# EAGLE design MonoPedal (EAGLE 9.6.2)

## Sheet 1 of 2: Audio & Power
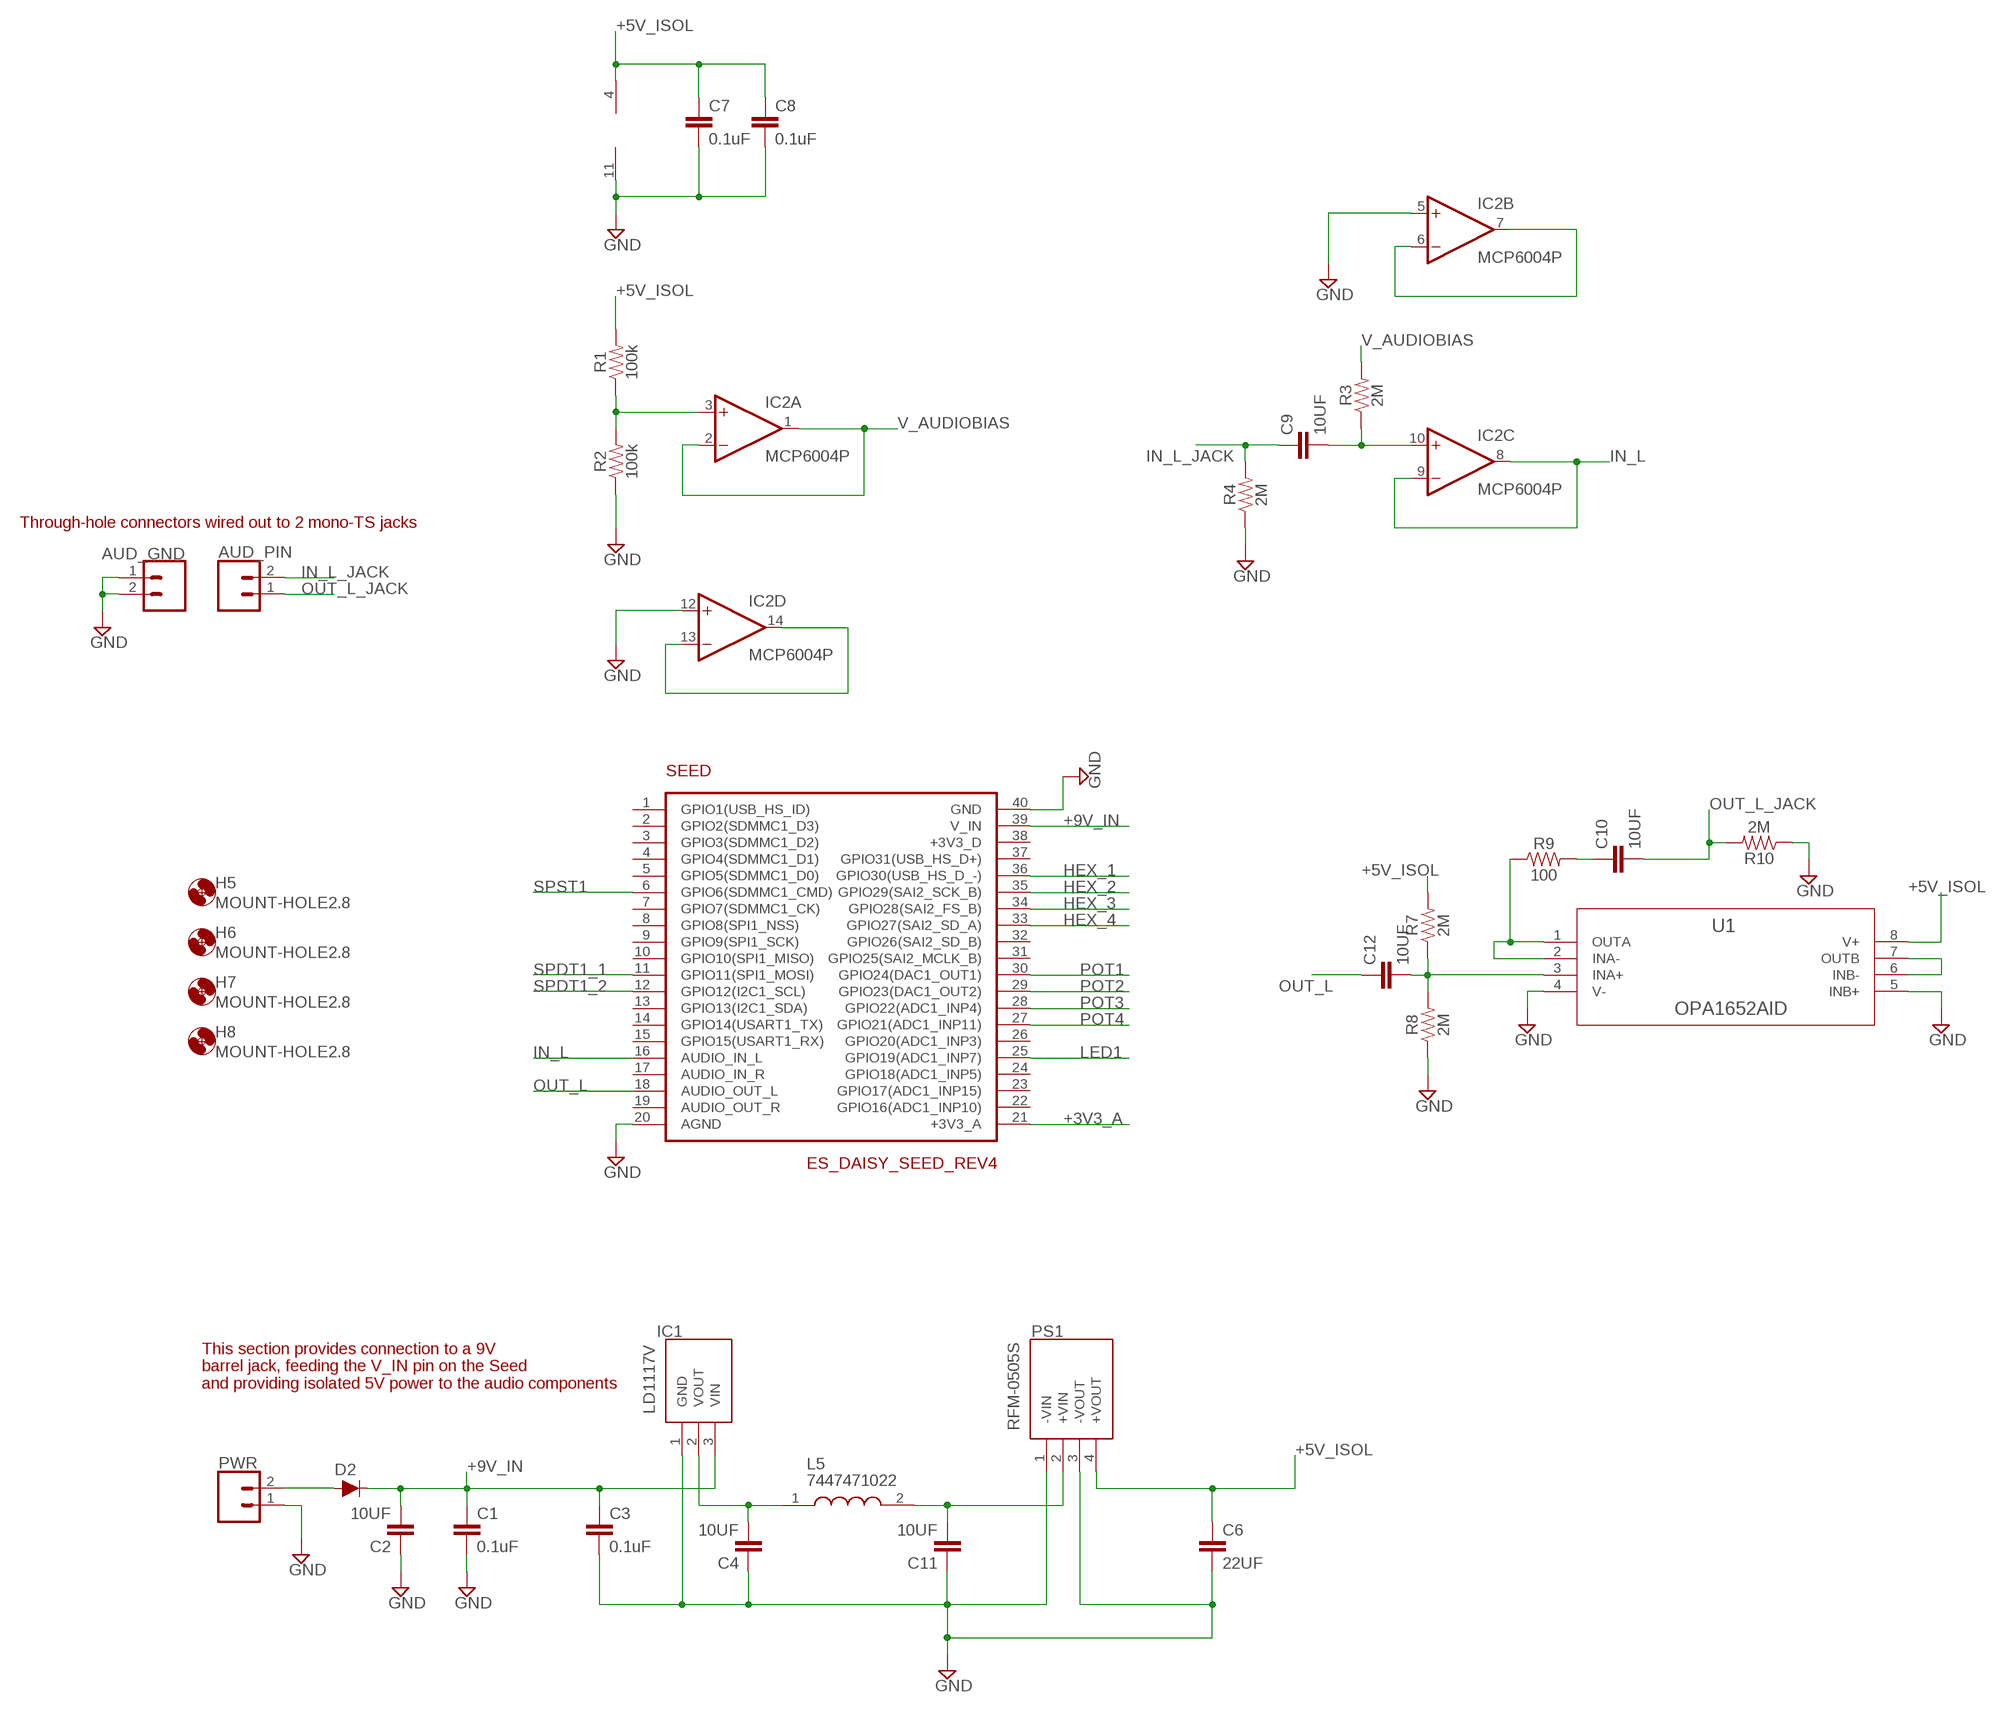
[diagram p0: schematic, sheet 1]

### Parts
AUD_GND  CONN_02  [1X02]
AUD_PIN  CONN_02  [1X02]
C1  0.1uF  0.1UF-KIT-EZ-50V-20%  [CAP-PTH-SMALL-KIT]
C2  10UF  [CAP-PTH-SMALL-KIT]
C3  0.1uF  0.1UF-KIT-EZ-50V-20%  [CAP-PTH-SMALL-KIT]
C4  10UF  [CAP-PTH-SMALL-KIT]
C6  22UF  [CAP-PTH-SMALL-KIT]
C7  0.1uF  0.1UF-KIT-EZ-50V-20%  [CAP-PTH-SMALL-KIT]
C8  0.1uF  0.1UF-KIT-EZ-50V-20%  [CAP-PTH-SMALL-KIT]
C9  10UF  [CAP-PTH-SMALL-KIT]
C10  10UF  [CAP-PTH-SMALL-KIT]
C11  10UF  [CAP-PTH-SMALL-KIT]
C12  10UF  [CAP-PTH-SMALL-KIT]
D2  200mA/100V/1V  DIODE-1N4148  [DIODE-1N4148]
H5  MOUNT-HOLE2.8  [2,8]
H6  MOUNT-HOLE2.8  [2,8]
H7  MOUNT-HOLE2.8  [2,8]
H8  MOUNT-HOLE2.8  [2,8]
IC1  LD1117V  [TO255P460X1020X2008-3P]
IC2  MCP6004P  [DIL14]
L5  7447471022  [WE-TIS_111190]
PS1  RFM-0505S  [RFM0505S]
PWR  CONN_02  [1X02]
R1  100k  100KOHM-HORIZ-1/4W-5%  [AXIAL-0.3]
R2  100k  100KOHM-HORIZ-1/4W-5%  [AXIAL-0.3]
R3  2M  2MOHM-HORIZ-1/4W-5%  [AXIAL-0.3]
R4  2M  2MOHM-HORIZ-1/4W-5%  [AXIAL-0.3]
R7  2M  2MOHM-HORIZ-1/4W-5%  [AXIAL-0.3]
R8  2M  2MOHM-HORIZ-1/4W-5%  [AXIAL-0.3]
R9  100  100OHM-HORIZ-1/4W-1%  [AXIAL-0.3]
R10  2M  2MOHM-HORIZ-1/4W-5%  [AXIAL-0.3]
SEED  ES_DAISY_SEED_REV4  [ES_DAISY_SEED]
U1  OPA1652AID  [D8]

### Nets
+3V3_A: SEED.21(+3V3_A) ; also sheet 2
+5V_ISOL: C6.1 C7.1 C8.1 IC2.4(P:V+) PS1.4(+VOUT) R1.P$2 R7.P$2 U1.8(V+)
+9V_IN: C1.1 C2.2 C3.1 D2.C IC1.3(VIN) SEED.39(V_IN)
GND: AUD_GND.1 AUD_GND.2 C1.2 C2.1 C3.2 C4.1 C6.2 C7.2 C8.2 C11.1 IC1.1(GND) IC2.5(B:+IN) IC2.11(P:V-) IC2.12(D:+IN) PS1.1(-VIN) PS1.3(-VOUT) PWR.1 R2.P$1 R4.P$1 R8.P$1 R10.P$1 SEED.20(AGND) SEED.40(GND) U1.4(V-) U1.5(INB+) ; also sheet 2
HEX_1: SEED.36(GPIO30(USB_HS_D_-)) ; also sheet 2
HEX_2: SEED.35(GPIO29(SAI2_SCK_B)) ; also sheet 2
HEX_3: SEED.34(GPIO28(SAI2_FS_B)) ; also sheet 2
HEX_4: SEED.33(GPIO27(SAI2_SD_A)) ; also sheet 2
IN_L: IC2.8(C:OUT) IC2.9(C:-IN) SEED.16(AUDIO_IN_L)
IN_L_JACK: AUD_PIN.2 C9.1 R4.P$2
LED1: SEED.25(GPIO19(ADC1_INP7)) ; also sheet 2
N$2: D2.A PWR.2
N$6: IC2.3(A:+IN) R1.P$1 R2.P$2
N$7: C11.2 L5.2 PS1.2(+VIN)
N$8: C4.2 IC1.2(VOUT) L5.1
N$9: C9.2 IC2.10(C:+IN) R3.P$1
N$10: IC2.13(D:-IN) IC2.14(D:OUT)
N$12: C12.2 R7.P$1 R8.P$2 U1.3(INA+)
N$13: R9.P$1 U1.1(OUTA) U1.2(INA-)
N$14: C10.1 R9.P$2
N$15: U1.6(INB-) U1.7(OUTB)
N$18: IC2.6(B:-IN) IC2.7(B:OUT)
OUT_L: C12.1 SEED.18(AUDIO_OUT_L)
OUT_L_JACK: AUD_PIN.1 C10.2 R10.P$2
POT1: SEED.30(GPIO24(DAC1_OUT1)) ; also sheet 2
POT2: SEED.29(GPIO23(DAC1_OUT2)) ; also sheet 2
POT3: SEED.28(GPIO22(ADC1_INP4)) ; also sheet 2
POT4: SEED.27(GPIO21(ADC1_INP11)) ; also sheet 2
SPDT1_1: SEED.11(GPIO11(SPI1_MOSI)) ; also sheet 2
SPDT1_2: SEED.12(GPIO12(I2C1_SCL)) ; also sheet 2
SPST1: SEED.6(GPIO6(SDMMC1_CMD)) ; also sheet 2
V_AUDIOBIAS: IC2.1(A:OUT) IC2.2(A:-IN) R3.P$2
Unconnected: SEED.1(GPIO1(USB_HS_ID)) SEED.2(GPIO2(SDMMC1_D3)) SEED.3(GPIO3(SDMMC1_D2)) SEED.4(GPIO4(SDMMC1_D1)) SEED.5(GPIO5(SDMMC1_D0)) SEED.7(GPIO7(SDMMC1_CK)) SEED.8(GPIO8(SPI1_NSS)) SEED.9(GPIO9(SPI1_SCK)) SEED.10(GPIO10(SPI1_MISO)) SEED.13(GPIO13(I2C1_SDA)) SEED.14(GPIO14(USART1_TX)) SEED.15(GPIO15(USART1_RX)) SEED.17(AUDIO_IN_R) SEED.19(AUDIO_OUT_R) SEED.22(GPIO16(ADC1_INP10)) SEED.23(GPIO17(ADC1_INP15)) SEED.24(GPIO18(ADC1_INP5)) SEED.26(GPIO20(ADC1_INP3)) SEED.31(GPIO25(SAI2_MCLK_B)) SEED.32(GPIO26(SAI2_SD_B)) SEED.37(GPIO31(USB_HS_D+)) SEED.38(+3V3_D)

### Notes on the sheet
- Through-hole connectors wired out to 2 mono-TS jacks
- This section provides connection to a 9V
  barrel jack, feeding the V_IN pin on the Seed 
  and providing isolated 5V power to the audio components

## Sheet 2 of 2: I/O
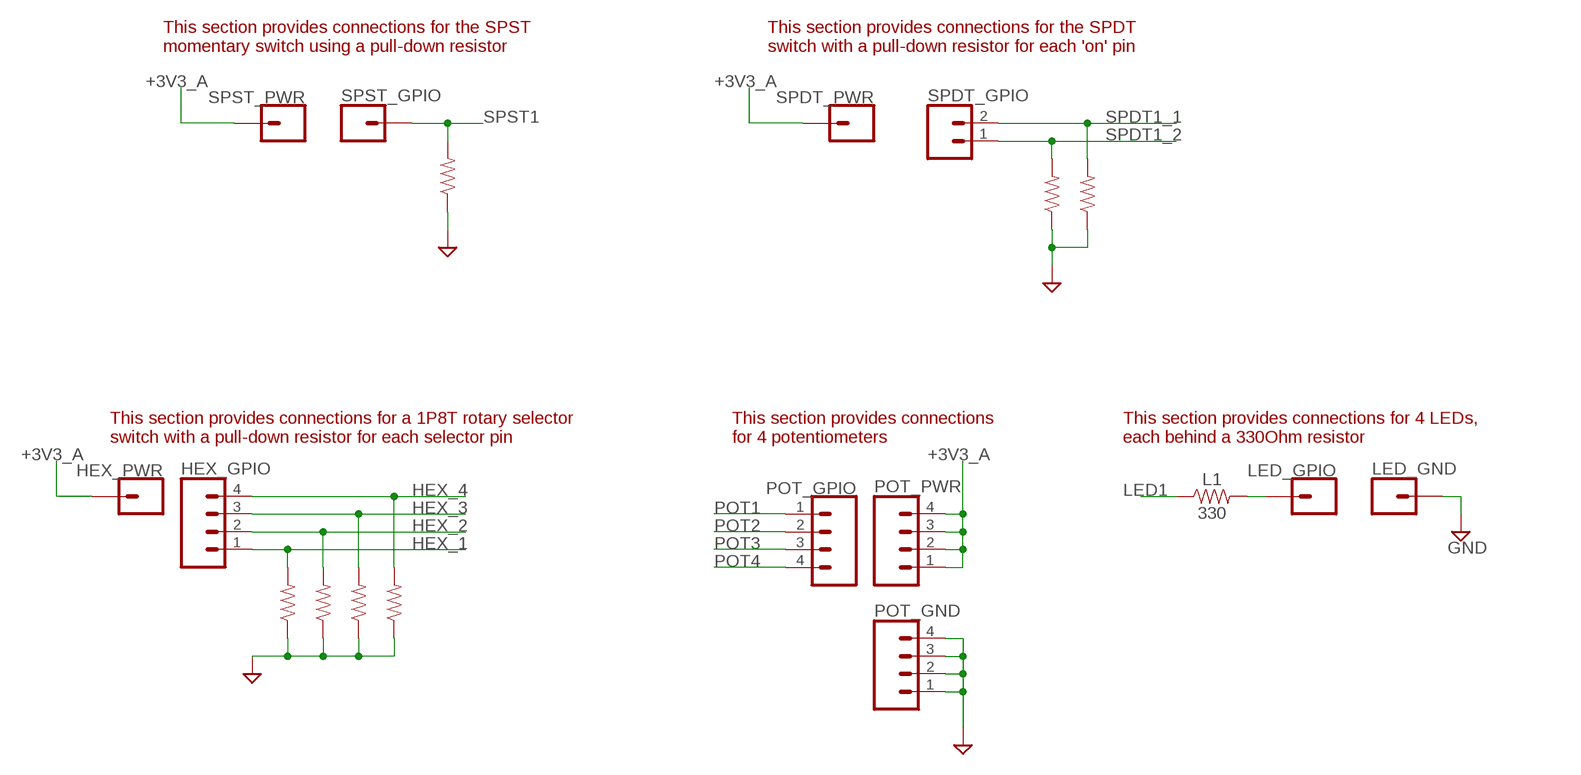
[diagram p1: schematic, sheet 2]

### Parts
D11  10k  10KOHM-HORIZ-1/4W-5%  [AXIAL-0.3]
D12  10k  10KOHM-HORIZ-1/4W-5%  [AXIAL-0.3]
H1  10k  10KOHM-HORIZ-1/4W-5%  [AXIAL-0.3]
H2  10k  10KOHM-HORIZ-1/4W-5%  [AXIAL-0.3]
H3  10k  10KOHM-HORIZ-1/4W-5%  [AXIAL-0.3]
H4  10k  10KOHM-HORIZ-1/4W-5%  [AXIAL-0.3]
HEX_GPIO  CONN_04  [1X04]
HEX_PWR  CONN_01  [1X01]
L1  330  330OHM-HORIZ-1/10W-5%  [AXIAL-0.3]
LED_GND  CONN_01  [1X01]
LED_GPIO  CONN_01  [1X01]
POT_GND  CONN_04  [1X04]
POT_GPIO  CONN_04  [1X04]
POT_PWR  CONN_04  [1X04]
S1  10k  10KOHM-HORIZ-1/4W-5%  [AXIAL-0.3]
SPDT_GPIO  CONN_02  [1X02]
SPDT_PWR  CONN_01  [1X01]
SPST_GPIO  CONN_01  [1X01]
SPST_PWR  CONN_01  [1X01]

### Nets
+3V3_A: HEX_PWR.1 POT_PWR.1 POT_PWR.2 POT_PWR.3 POT_PWR.4 SPDT_PWR.1 SPST_PWR.1 ; also sheet 1
GND: D11.P$1 D12.P$1 H1.P$1 H2.P$1 H3.P$1 H4.P$1 LED_GND.1 POT_GND.1 POT_GND.2 POT_GND.3 POT_GND.4 S1.P$1 ; also sheet 1
HEX_1: H1.P$2 HEX_GPIO.1 ; also sheet 1
HEX_2: H2.P$2 HEX_GPIO.2 ; also sheet 1
HEX_3: H3.P$2 HEX_GPIO.3 ; also sheet 1
HEX_4: H4.P$2 HEX_GPIO.4 ; also sheet 1
LED1: L1.P$1 ; also sheet 1
N$1: L1.P$2 LED_GPIO.1
POT1: POT_GPIO.1 ; also sheet 1
POT2: POT_GPIO.2 ; also sheet 1
POT3: POT_GPIO.3 ; also sheet 1
POT4: POT_GPIO.4 ; also sheet 1
SPDT1_1: D11.P$2 SPDT_GPIO.2 ; also sheet 1
SPDT1_2: D12.P$2 SPDT_GPIO.1 ; also sheet 1
SPST1: S1.P$2 SPST_GPIO.1 ; also sheet 1

### Notes on the sheet
- This section provides connections for the SPST 
  momentary switch using a pull-down resistor
- This section provides connections for the SPDT 
  switch with a pull-down resistor for each 'on' pin
- This section provides connections for a 1P8T rotary selector
  switch with a pull-down resistor for each selector pin
- This section provides connections
  for 4 potentiometers
- This section provides connections for 4 LEDs,
  each behind a 330Ohm resistor

## Library data of the parts
AUD_GND AUD_PIN PWR SPDT_GPIO = SparkFun-Connectors:CONN_02: Multi connection point. Often used as Generic Header-pin footprint for 0.1 inch spaced/style header connections On any of the 0.1 inch spaced packages, you can populate with these: Break Away Headers - Straight <https://www.sparkfun.com/products/116> (PRT-00116) Break Away Male Headers - Right Angle <https://www.sparkfun.com/products/553> (PRT-00553) Female Headers <https://www.sparkfun.com/products/115> (PRT-00115) Break Away Headers - Machine Pin <https://www.sparkfun.com/products/117> (PRT-00117) Break Away Female Headers - Swiss Machine Pin <https://www.sparkfun.com/products/743> (PRT-00743) For SCREWTERMINALS and SPRING TERMINALS visit here: Screw Terimnals on SparkFun.com <https://www.sparkfun.com/search/results?term=Screw+Terminals> (5mm/3.5mm/2.54mm spacing) This device is also useful as a general connection point to wire up your design to another part of your project. Our various solder wires solder well into these plated through hole pads. Hook-Up Wire - Assortment (Stranded, 22 AWG) <https://www.sparkfun.com/products/11375> (PRT-11375) Hook-Up Wire - Assortment (Solid Core, 22 AWG) <https://www.sparkfun.com/products/11367> (PRT-11367) View the entire wire category on our website here <https://www.sparkfun.com/categories/141> Special notes: Molex polarized connector foot print use with: PRT-08233 with associated crimp pins and housings. 2.54_SCREWTERM for use with PRT-10571. 3.5mm Screw Terminal footprints for PRT-08084 5mm Screw Terminal footprints for use with PRT-08432
C1 C3 C7 C8 = SparkFun-Capacitors:0.1UF: 0.1µF ceramic capacitors A capacitor is a passive two-terminal electrical component used to store electrical energy temporarily in an electric field.; PROD_ID: CAP-08370
C2 C4 C9-C12 = Custom-Parts:10UF
C6 = Custom-Parts:22UF
D2 = SparkFun-DiscreteSemi:DIODE: Diode These are standard reverse protection diodes and small signal diodes. SparkFun Products: SparkFun SparkPunk Sound Kit <https://www.sparkfun.com/products/11177> SparkFun ESP8266 Thing <https://www.sparkfun.com/products/13231>; PROD_ID: DIO-08378
D11 D12 H1-H4 S1 = SparkFun-Resistors:10KOHM: 10kΩ resistor A resistor is a passive two-terminal electrical component that implements electrical resistance as a circuit element. Resistors act to reduce current flow, and, at the same time, act to lower voltage levels within circuits. - Wikipedia; PROD_ID: RES-09435
H5-H8 = holes:MOUNT-HOLE: MOUNTING HOLE with drill center marker
HEX_GPIO POT_GND POT_GPIO POT_PWR = SparkFun-Connectors:CONN_04: Multi connection point. Often used as Generic Header-pin footprint for 0.1 inch spaced/style header connections On any of the 0.1 inch spaced packages, you can populate with these: Break Away Headers - Straight <https://www.sparkfun.com/products/116> (PRT-00116) Break Away Male Headers - Right Angle <https://www.sparkfun.com/products/553> (PRT-00553) Female Headers <https://www.sparkfun.com/products/115> (PRT-00115) Break Away Headers - Machine Pin <https://www.sparkfun.com/products/117> (PRT-00117) Break Away Female Headers - Swiss Machine Pin <https://www.sparkfun.com/products/743> (PRT-00743) For SCREWTERMINALS and SPRING TERMINALS visit here: Screw Terimnals on SparkFun.com <https://www.sparkfun.com/search/results?term=Screw+Terminals> (5mm/3.5mm/2.54mm spacing) This device is also useful as a general connection point to wire up your design to another part of your project. Our various solder wires solder well into these plated through hole pads. Hook-Up Wire - Assortment (Stranded, 22 AWG) <https://www.sparkfun.com/products/11375> (PRT-11375) Hook-Up Wire - Assortment (Solid Core, 22 AWG) <https://www.sparkfun.com/products/11367> (PRT-11367) View the entire wire category on our website here <https://www.sparkfun.com/categories/141> Special notes: Molex polarized connector foot print use with SKU : PRT-08231 with associated crimp pins and housings. 1MM SMD Version SKU: PRT-10208; PROD_ID: CONN-09696
HEX_PWR LED_GND LED_GPIO SPDT_PWR SPST_GPIO SPST_PWR = SparkFun-Connectors:CONN_01: Single connection point. Often used as Generic Header-pin footprint for 0.1 inch spaced/style header connections On any of the 0.1 inch spaced packages, you can populate with these: Break Away Headers - Straight <https://www.sparkfun.com/products/116> (PRT-00116) Break Away Male Headers - Right Angle <https://www.sparkfun.com/products/553> (PRT-00553) Female Headers <https://www.sparkfun.com/products/115> (PRT-00115) Break Away Headers - Machine Pin <https://www.sparkfun.com/products/117> (PRT-00117) Break Away Female Headers - Swiss Machine Pin <https://www.sparkfun.com/products/743> (PRT-00743) This device is also useful as a general connection point to wire up your design to another part of your project. Our various solder wires solder well into these plated through hole pads. Hook-Up Wire - Assortment (Stranded, 22 AWG) <https://www.sparkfun.com/products/11375> (PRT-11375) Hook-Up Wire - Assortment (Solid Core, 22 AWG) <https://www.sparkfun.com/products/11367> (PRT-11367) View the entire wire category on our website here <https://www.sparkfun.com/categories/141> Special notes: SMTSO-256-ET is a "flush mount" nut for a 4-40 screw. We mostly use this on specialty testbeds; it is a nice way to connect hardware to your PCB at an adjustable hieght. Also note, the SNAP packages are for using a snappable style connector. We sell a baggie of snaps and they are also used on two LilyPad designs: Snap Assortment - 30 pack (male and female) <https://www.sparkfun.com/products/11347> (DEV-11347) LilyPad Arduino SimpleSnap <https://www.sparkfun.com/products/10941> (DEV-10941) LilyPad SimpleSnap Protoboard <https://www.sparkfun.com/products/10940> (DEV-10940)
IC1 = SamacSys_Parts:LD1117V: I.C. LD1117V Source: Datasheet <https://www.mouser.com/datasheet/2/389/ld1117-974075.pdf>; ARROW_PART_NUMBER: LD1117V; ARROW_PRICE-STOCK: https://www.arrow.com/en/products/ld1117v/stmicroelectronics; DESCRIPTION: I.C. LD1117V; HEIGHT: 4.6mm; MANUFACTURER_NAME: STMicroelectronics; MANUFACTURER_PART_NUMBER: LD1117V; MOUSER_PART_NUMBER: 511-LD1117V; MOUSER_PRICE-STOCK: https://www.mouser.co.uk/ProductDetail/STMicroelectronics/LD1117V?qs=tZUCD5p2VWqhC74a4KMNzA%3D%3D
IC2 = Custom-Parts:MCP6004: Quad Op Amp 2.7V to 6.0V Single Supply CMOS Source: https://www.mouser.com/datasheet/2/268/21733e-41017.pdf
L1 = SparkFun-Resistors:330OHM: 330Ω resistor A resistor is a passive two-terminal electrical component that implements electrical resistance as a circuit element. Resistors act to reduce current flow, and, at the same time, act to lower voltage levels within circuits. - Wikipedia; PROD_ID: RES-8371
L5 = SamacSys_Parts:7447471022: Wurth 2.2 uH +/-20% Ferrite Leaded Inductor, Max SRF:75MHz, 10A Idc, 0.009 Rdc WE-TIS Source: Datasheet <https://componentsearchengine.com/Datasheets/1/7447471022.pdf>; DESCRIPTION: Wurth 2.2 uH +/-20% Ferrite Leaded Inductor, Max SRF:75MHz, 10A Idc, 0.009 Rdc WE-TIS; HEIGHT: mm; MANUFACTURER_NAME: Wurth Elektronik; MANUFACTURER_PART_NUMBER: 7447471022; MOUSER_PART_NUMBER: 710-7447471022; MOUSER_PRICE-STOCK: https://www.mouser.com/Search/Refine.aspx?Keyword=710-7447471022
PS1 = SamacSys_Parts:RFM-0505S: RECOM POWER - RFM-0505S - DC-DC CONVERTER, 5V, 0.2A Source: Datasheet <https://www.recom-power.com/pdf/Econoline/RFM.pdf>; DESCRIPTION: RECOM POWER - RFM-0505S - DC-DC CONVERTER, 5V, 0.2A; HEIGHT: 10.5mm; MANUFACTURER_NAME: RECOM Power; MANUFACTURER_PART_NUMBER: RFM-0505S; MOUSER_PART_NUMBER: 919-RFM-0505S; MOUSER_PRICE-STOCK: https://www.mouser.co.uk/ProductDetail/RECOM-Power/RFM-0505S?qs=lYGu3FyN48dRVYKTH5ipqg%3D%3D
R1 R2 = SparkFun-Resistors:100KOHM: 100kΩ resistor A resistor is a passive two-terminal electrical component that implements electrical resistance as a circuit element. Resistors act to reduce current flow, and, at the same time, act to lower voltage levels within circuits. - Wikipedia; PROD_ID: RES-10686
R3 R4 R7 R8 R10 = Custom-Parts:2MOHM: 2MΩ resistor A resistor is a passive two-terminal electrical component that implements electrical resistance as a circuit element. Resistors act to reduce current flow, and, at the same time, act to lower voltage levels within circuits. - Wikipedia; PROD_ID: RES-09329
R9 = SparkFun-Resistors:100OHM: 100Ω resistor A resistor is a passive two-terminal electrical component that implements electrical resistance as a circuit element. Resistors act to reduce current flow, and, at the same time, act to lower voltage levels within circuits. - Wikipedia; PROD_ID: RES-12181
SEED = Electrosmith-Boards:ES_DAISY_SEED_REV4; IPN: Daisy Seed
U1 = Custom-Parts:OPA1652AID; DATASHEET_URL: http://www.ti.com/lit/gpn/OPA1652; DESCRIPTION: Sound Plus Low Noise and Distortion, General-Purpose, FET-Input Audio Op Amps; FAMILY_NAME: LOW NOISE; GENERIC_PART_NUMBER: OPA1652; INDUSTRY_STD_PKG_TYPE: SOIC; MANUFACTURER: Texas Instruments; MANUFACTURER_PART_NUMBER: OPA1652AID; PACKAGE_DESIGNATOR: D; PIN_COUNT: 8; VENDOR: Texas Instruments

## Net classes
0 DEFAULT: width 0.102 mm, drill 0.2 mm, clearance 0.102 mm

## Board
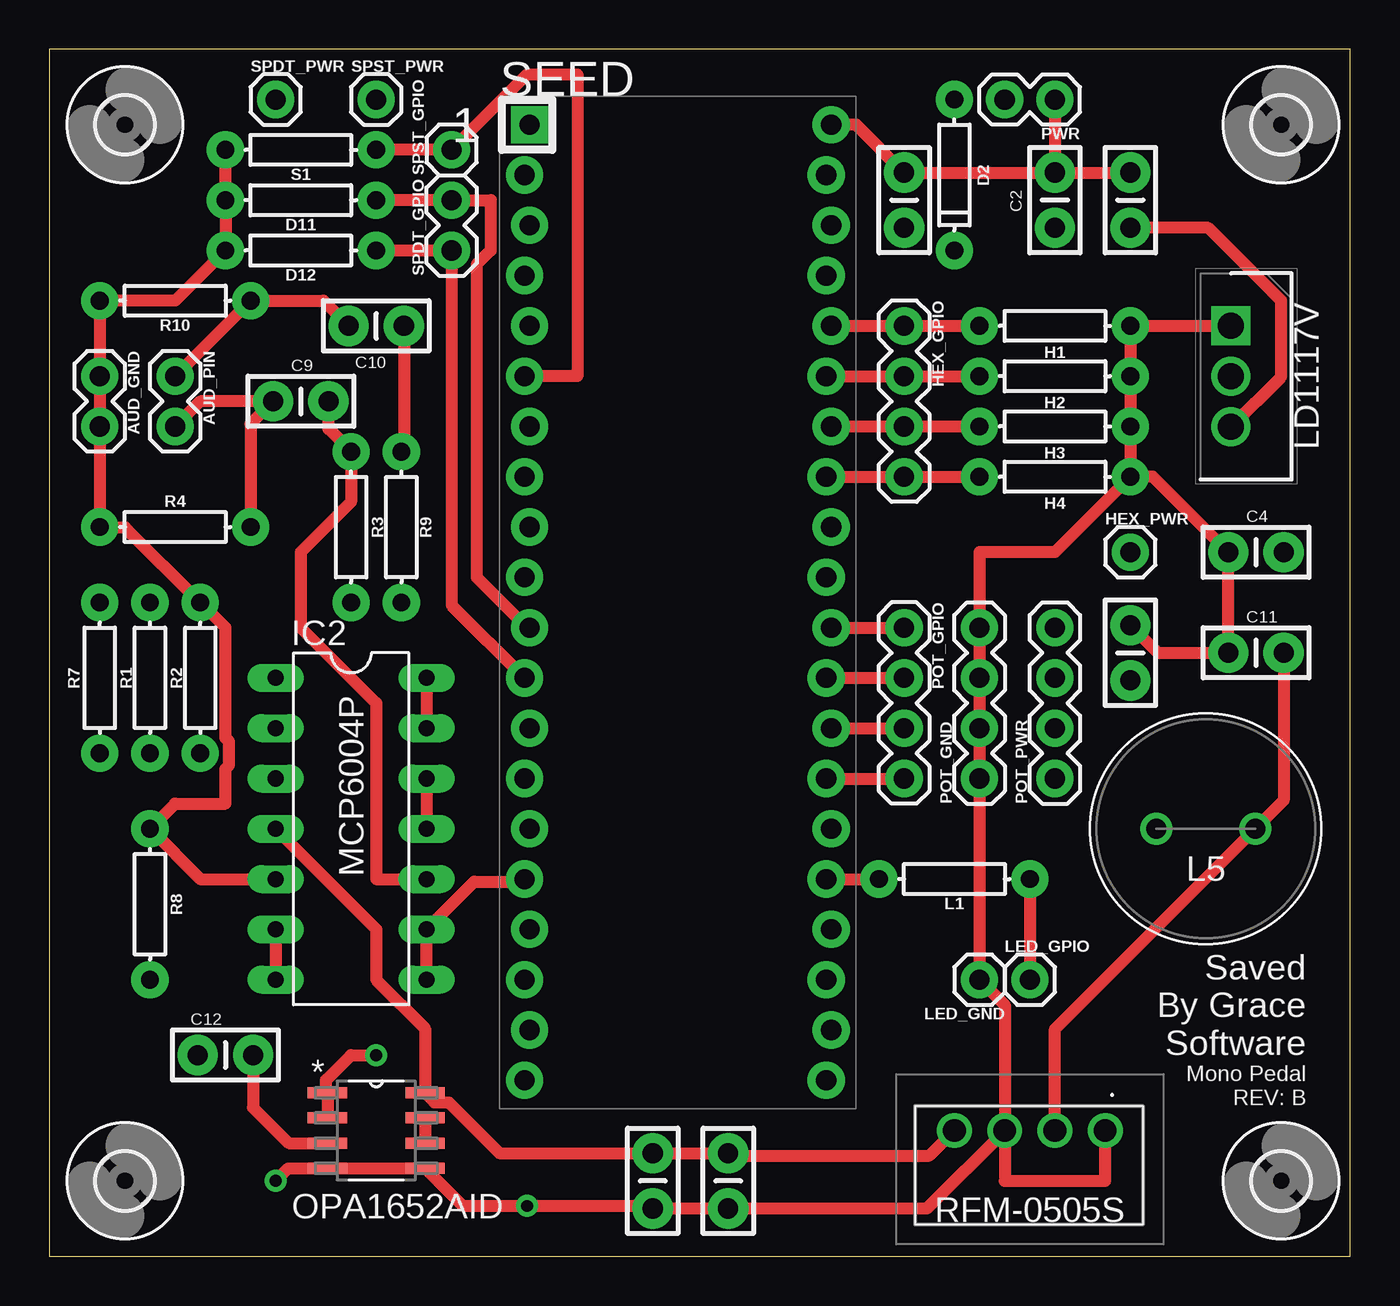
[diagram p2: board, top side]
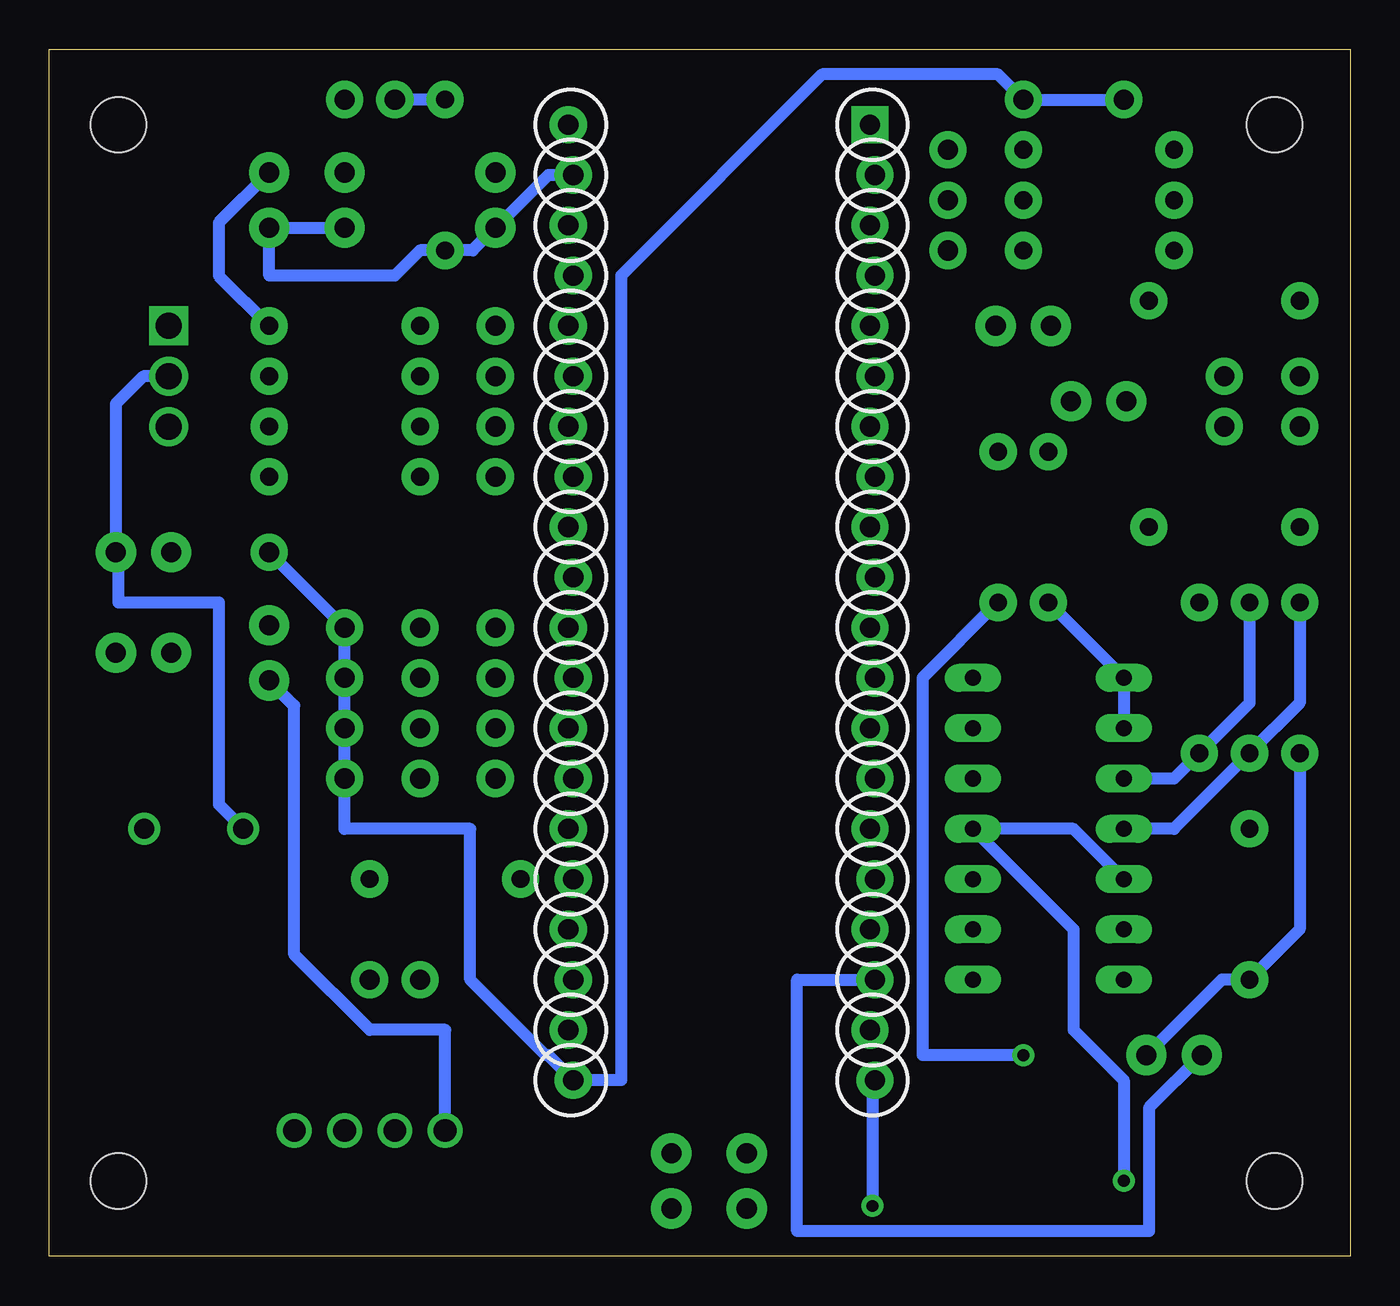
[diagram p3: board, bottom side, seen from below]

Size 65.71 x 60.95 mm. Coordinates in mm from the lower left corner, seen from the top.
Outline: 0,0 65.71,0 65.71,60.95 0,60.95 0,0
Copper layers (1*16): Top 0.035mm / dielectric 1.5mm / Bottom 0.035mm
Design rules "SparkFun": minimum track width 8mil, minimum drill 20mil, track to track 8mil, track to pad 8mil, pad to pad 8mil, via to via 8mil, smd to smd 8mil, copper to edge 8mil, drill to drill 8mil, minimum pad ring 12mil, minimum via ring 10mil, stop-mask expansion 4mil, vias tented up to drill 20mil, thermal gap 10mil

### Footprints (pad centres in the part's own frame; a part is rotated, then mirrored left to right if it is on the bottom)
1X02 = drill 1.016 pad 1.88: 1 0,0; 2 2.54,0
CAP-PTH-SMALL-KIT = drill 1.016 pad 2.032: 1 -1.397,0; 2 1.397,0
DIODE-1N4148 = drill 0.9 pad 1.88: A -3.81,0; C 3.81,0
AXIAL-0.3 = drill 0.9 pad 1.88: P$1 -3.81,0; P$2 3.81,0
2,8 = hole 2.8: 0,0
1X04 = drill 1.016 pad 1.88: 1 0,0; 2 2.54,0; 3 5.08,0; 4 7.62,0
1X01 = drill 1.016 pad 1.88: 1 0,0
TO255P460X1020X2008-3P = drill 1.32 pad 1.98 square: 1 0,0 | drill 1.32 pad 1.98: 2 2.55,0; 3 5.1,0
DIL14 = drill 0.813 long: 1 -7.62,-3.81; 2 -5.08,-3.81; 3 -2.54,-3.81; 4 0,-3.81; 5 2.54,-3.81; 6 5.08,-3.81; 7 7.62,-3.81; 8 7.62,3.81; 9 5.08,3.81; 10 2.54,3.81; 11 0,3.81; 12 -2.54,3.81; 13 -5.08,3.81; 14 -7.62,3.81
WE-TIS_111190 = drill 1 pad 1.5: 1 -2.5,0; 2 2.5,0
RFM0505S = drill 1.15 pad 1.725: 1 0,0; 2 2.54,0; 3 5.08,0; 4 7.62,0
ES_DAISY_SEED = drill 1.016 pad 1.88 square: 1 -7.493,24.13 | drill 1.016 pad 1.88: 2 -7.747,21.59; 3 -7.493,19.05; 4 -7.747,16.51; 5 -7.493,13.97; 6 -7.747,11.43; 7 -7.493,8.89; 8 -7.747,6.35; 9 -7.493,3.81; 10 -7.747,1.27; 11 -7.493,-1.27; 12 -7.747,-3.81; 13 -7.493,-6.35; 14 -7.747,-8.89; 15 -7.493,-11.43; 16 -7.747,-13.97; 17 -7.493,-16.51; 18 -7.747,-19.05; 19 -7.493,-21.59; 20 -7.747,-24.13; 21 7.493,-24.13; 22 7.747,-21.59; 23 7.493,-19.05; 24 7.747,-16.51; 25 7.493,-13.97; 26 7.747,-11.43; 27 7.493,-8.89; 28 7.747,-6.35; 29 7.493,-3.81; 30 7.747,-1.27; 31 7.493,1.27; 32 7.747,3.81; 33 7.493,6.35; 34 7.747,8.89; 35 7.493,11.43; 36 7.747,13.97; 37 7.493,16.51; 38 7.747,19.05; 39 7.493,21.59; 40 7.747,24.13
D8 = smd 1.981 x 0.559: 1 -2.464,1.905; 2 -2.464,0.635; 3 -2.464,-0.635; 4 -2.464,-1.905; 5 2.464,-1.905; 6 2.464,-0.635; 7 2.464,0.635; 8 2.464,1.905

### Placement (x,y rotation side)
AUD_GND  2.54,44.45 270 top
AUD_PIN  6.35,44.45 270 top
C1  43.18,53.34 90 top
C2  50.8,53.34 270 top
C3  54.61,53.34 90 top
C4  60.96,35.56 0 top
C6  54.61,30.48 90 top
C7  30.48,3.81 270 top
C8  34.29,3.81 270 top
C9  12.7,43.18 0 top
C10  16.51,46.99 180 top
C11  60.96,30.48 0 top
C12  8.89,10.16 0 top
D2  45.72,54.61 270 top
D11  12.7,53.34 0 top
D12  12.7,50.8 0 top
H1  50.8,46.99 180 top
H2  50.8,44.45 180 top
H3  50.8,41.91 180 top
H4  50.8,39.37 180 top
H5  3.81,3.81 0 top
H6  62.23,57.15 0 top
H7  62.23,3.81 0 top
H8  3.81,57.15 0 top
HEX_GPIO  43.18,46.99 270 top
HEX_PWR  54.61,35.56 0 top
IC1  59.69,46.99 270 top
IC2  15.24,21.59 270 top
L1  45.72,19.05 0 top
L5  58.42,21.59 0 top
LED_GND  46.99,13.97 180 top
LED_GPIO  49.53,13.97 0 top
POT_GND  46.99,24.13 90 top
POT_GPIO  43.18,31.75 270 top
POT_PWR  50.8,24.13 90 top
PS1  53.34,6.35 180 top
PWR  50.8,58.42 180 top
R1  5.08,29.21 270 top
R2  7.62,29.21 270 top
R3  15.24,36.83 270 top
R4  6.35,36.83 0 top
R7  2.54,29.21 90 top
R8  5.08,17.78 270 top
R9  17.78,36.83 90 top
R10  6.35,48.26 0 top
S1  12.7,55.88 0 top
SEED  31.75,33.02 0 top
SPDT_GPIO  20.32,50.8 90 top
SPDT_PWR  11.43,58.42 0 top
SPST_GPIO  20.32,55.88 90 top
SPST_PWR  16.51,58.42 0 top
U1  16.51,6.35 0 top

### Tracks (layer width: path | path; a pad name or v marks a point on that pad's centre or on a via)
+3V3_A
  Bottom 0.61: SPDT_PWR.1 SPST_PWR.1 17.78,59.69 26.67,59.69 36.83,49.53 36.83,8.89 SEED.21 40.51,10.16 40.64,10.16 44.45,13.97 44.45,21.59 50.8,21.59 POT_PWR.1 POT_PWR.2 POT_PWR.3 POT_PWR.4 HEX_PWR.1
+5V_ISOL
  Top 0.61: IC2.4 16.51,16.51 16.51,13.97 18.97,11.51 U1.8 19.46,7.77 20.18,7.77 22.74,5.21 C7.1 C8.1 34.42,5.08 44.45,5.08 PS1.4
  Bottom 0.61: PS1.4 45.72,11.43 49.53,11.43 53.34,15.24 53.34,27.81 C6.1 | IC2.4 8.89,21.59 R1.P$2 2.54,27.94 R7.P$2
+9V_IN
  Top 0.61: IC1.3 62.23,44.43 62.23,48.26 58.55,51.94 C3.1
  Bottom 0.61: SEED.39 40.51,54.61 C1.1 44.32,50.8 D2.C 46.99,50.8 48.26,49.53 54.61,49.53 C3.1 C2.2
GND  (via drill 0.6)
  Top 0.61: H4.P$1 H3.P$1 H2.P$1 H1.P$1 IC1.1 | H4.P$1 50.8,35.56 46.99,35.56 POT_GND.4 POT_GND.3 POT_GND.2 POT_GND.1 LED_GND.1 48.26,12.7 PS1.3 | S1.P$1 D11.P$1 D12.P$1 6.35,48.26 R10.P$1 AUD_GND.1 AUD_GND.2 R4.P$1 3.81,36.83 R2.P$1 8.89,31.75 8.89,26.18 9.07,26 9.07,24.8 8.89,24.62 8.89,22.86 6.35,22.86 R8.P$1 7.62,19.05 IC2.5 | PS1.3 44.32,2.41 C8.2 C7.2 30.35,2.54 v24.13,2.54 20.88,2.54 U1.5 U1.4 12.06,4.45 v11.43,3.81 | H4.P$1 54.62,39.38 55.74,39.38 C4.1 C11.1 56.01,30.48 C6.2 | SEED.40 40.77,57.15 C1.2 C2.1 | PS1.3 48.26,3.81 53.34,3.81 PS1.1 | IC2.12 IC2.11 | C2.1 C3.2 | PWR.1 C2.1
  Bottom 0.61: IC2.5 13.97,21.59 IC2.11 13.97,16.51 13.97,11.43 11.43,8.89 v11.43,3.81 | SEED.20 24.13,8.76 v24.13,2.54 | C3.2 57.15,52.2 57.15,49.53 H1.P$1
HEX_1
  Top 0.61: SEED.36 HEX_GPIO.1 H1.P$2
HEX_2
  Top 0.61: SEED.35 HEX_GPIO.2 H2.P$2
HEX_3
  Top 0.61: SEED.34 HEX_GPIO.3 H3.P$2
HEX_4
  Top 0.61: SEED.33 HEX_GPIO.4 H4.P$2
IN_L
  Top 0.61: IC2.8 IC2.9 21.46,18.92 24,18.92 SEED.16
IN_L_JACK
  Top 0.61: AUD_PIN.2 7.62,43.18 C9.1 10.16,42.04 R4.P$2
LED1
  Top 0.61: SEED.25 L1.P$1
N$1
  Top 0.61: L1.P$2 LED_GPIO.1
N$2
  Bottom 0.61: D2.A PWR.2
N$6
  Bottom 0.61: R1.P$1 5.08,27.94 R2.P$2 8.89,24.13 IC2.3
N$7
  Top 0.61: PS1.2 50.8,11.47 L5.2 62.36,23.03 C11.2
N$8
  Bottom 0.61: IC1.2 60.97,44.44 62.36,43.05 C4.2 62.23,35.43 62.23,33.02 57.15,33.02 57.15,22.82 L5.1
N$9
  Top 0.61: IC2.10 16.51,19.05 16.51,27.94 12.7,31.75 12.7,35.56 15.24,38.1 R3.P$1 14.1,41.78 C9.2
N$10
  Top 0.61: IC2.14 IC2.13
N$12
  Top 0.61: U1.3 12.09,5.71 10.29,7.51 C12.2
  Bottom 0.61: R7.P$1 2.54,16.51 R8.P$2 6.48,13.97 C12.2
N$13  (via drill 0.6)
  Top 0.61: U1.2 U1.1 13.97,8.33 13.97,8.89 15.24,10.16 v16.51,10.16
  Bottom 0.61: R9.P$1 21.59,29.21 21.59,10.16 v16.51,10.16
N$14
  Top 0.61: C10.1 17.91,40.77 R9.P$2
N$15
  Top 0.61: U1.7 U1.6
N$18
  Top 0.61: IC2.6 IC2.7
OUT_L
  Bottom 0.61: SEED.18 27.94,13.97 27.94,1.27 10.16,1.27 10.16,7.49 C12.1
OUT_L_JACK
  Top 0.61: AUD_PIN.1 R10.P$2 13.84,48.26 C10.2
POT1
  Top 0.61: SEED.30 POT_GPIO.1
POT2
  Top 0.61: SEED.29 POT_GPIO.2
POT3
  Top 0.61: SEED.28 POT_GPIO.3
POT4
  Top 0.61: SEED.27 POT_GPIO.4
SPDT1_1
  Top 0.61: D11.P$2 SPDT_GPIO.2 22.3,53.34 22.3,50.8 21.59,50.09 21.59,34.29 24.13,31.75 SEED.11
SPDT1_2
  Top 0.61: D12.P$2 SPDT_GPIO.1 20.32,32.89 SEED.12
SPST1
  Top 0.61: S1.P$2 SPST_GPIO.1 24.13,59.69 26.67,59.69 26.67,44.45 SEED.6
V_AUDIOBIAS
  Bottom 0.61: R3.P$2 IC2.1 IC2.2

### Text on the board
tNames: Saved / By Grace / Software | Mono Pedal / REV: B